# EAGLE design USB_Power_Board (EAGLE 7.3.0)
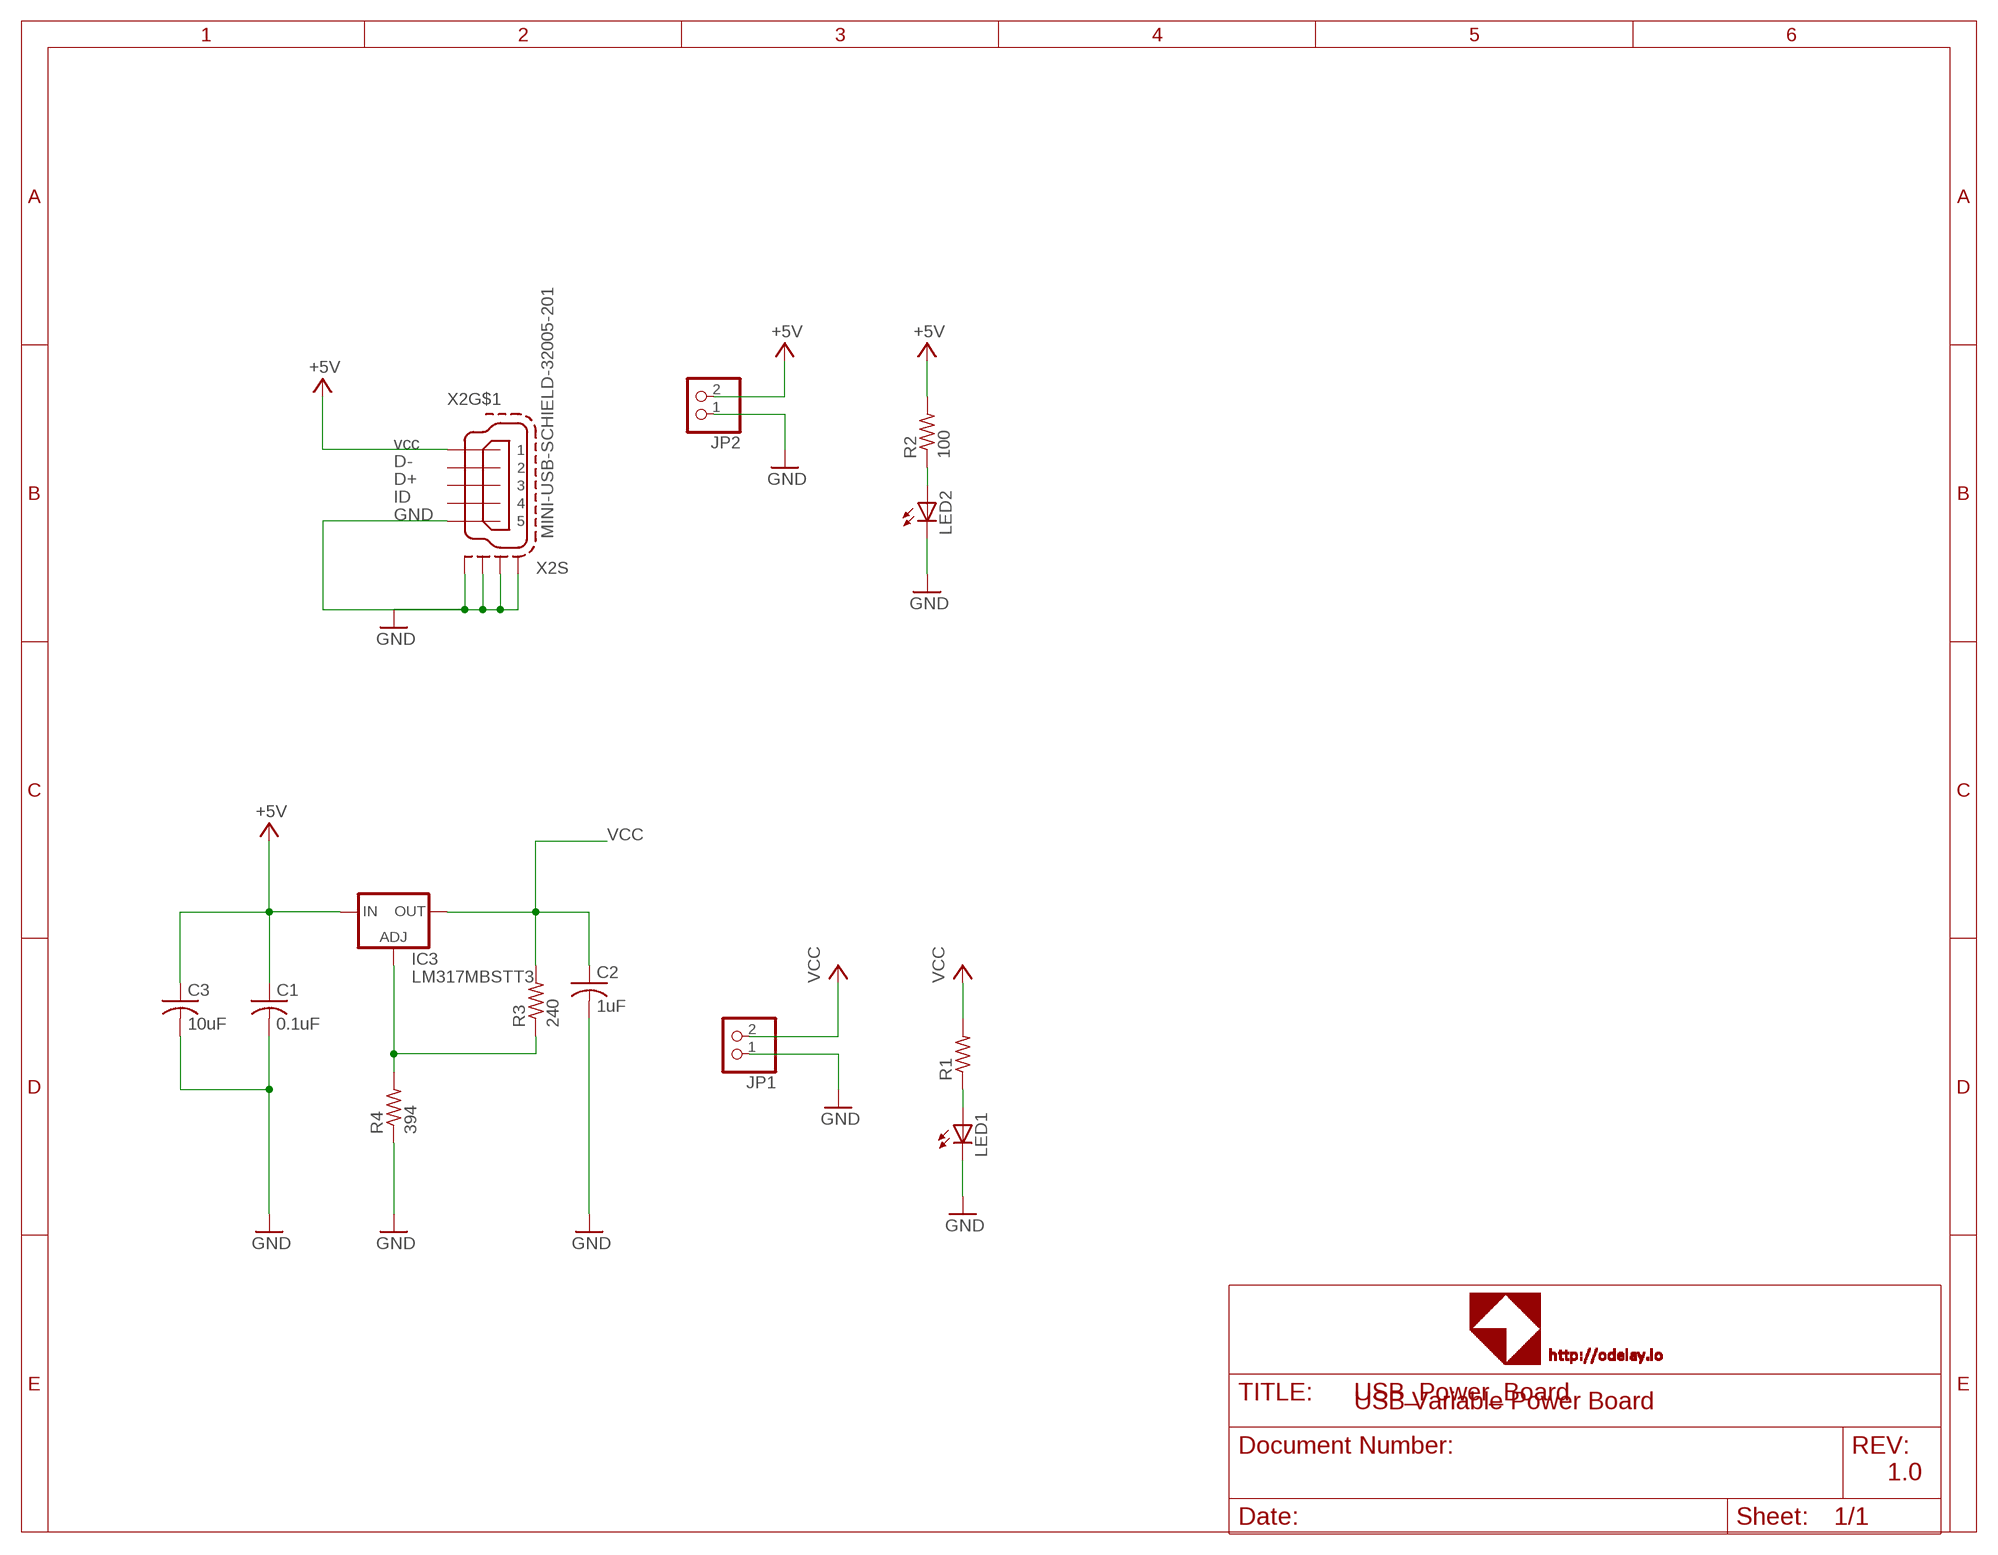
[diagram p0: schematic, sheet 1]

## Parts
C1  0.1uF  C-USC0402  [C0402]
C2  1uF  C-USC0402  [C0402]
C3  10uF  C-USC0603  [C0603]
IC3  LM317MBSTT3  [SOT223]
JP1  PINHD-1X2  [1X02]
JP2  PINHD-1X2  [1X02]
LED1  LEDCHIP-LED0603  [CHIP-LED0603]
LED2  LEDCHIP-LED0603  [CHIP-LED0603]
R1  R-US_R0402  [R0402]
R2  100  R-US_R0402  [R0402]
R3  240  R-US_R0805  [R0805]
R4  394  R-US_R0805  [R0805]
X2  MINI-USB-SCHIELD-32005-201  [32005-201]

## Nets
+5V: C1.1 C3.1 IC3.3(IN) JP2.2 R2.2 X2.1
GND: C1.2 C2.2 C3.2 JP1.1 JP2.1 LED1.C LED2.C R4.1 X2.5 X2.M1(S:S1) X2.M2(S:S2) X2.M3(S:S3) X2.M4(S:S4)
N$1: LED1.A R1.1
N$2: IC3.1(ADJ) R3.1 R4.2
N$5: LED2.A R2.1
VCC: C2.1 IC3.4(OUT) JP1.2 R1.2 R3.2
Unconnected: X2.2 X2.3 X2.4

## Notes on the sheet
- USB Variable Power Board
- 1.0

## Library data of the parts
C1-C3 = rcl:C-US: CAPACITOR, American symbol
IC3 = v-reg:LM317?*: 500 mA Adjustable Output Positive Voltage Regulator Source: http://www.onsemi.co.jp .. LM317M-D.PDF
JP1 JP2 = pinhead:PINHD-1X2: PIN HEADER
LED1 LED2 = led:LED: LED OSRAM: - CHIPLED LG R971, LG N971, LY N971, LG Q971, LY Q971, LO R971, LY R971 LH N974, LH R974 LS Q976, LO Q976, LY Q976 LO Q996 - Hyper CHIPLED LW Q18S LB Q993, LB Q99A, LB R99A - SideLED LS A670, LO A670, LY A670, LG A670, LP A670 LB A673, LV A673, LT A673, LW A673 LH A674 LY A675 LS A676, LA A676, LO A676, LY A676, LW A676 LS A679, LY A679, LG A679 - Hyper Micro SIDELED® LS Y876, LA Y876, LO Y876, LY Y876 LT Y87S - SmartLED LW L88C, LW L88S LB L89C, LB L89S, LG L890 LS L89K, LO L89K, LY L89K LS L896, LA L896, LO L896, LY L896 - TOPLED LS T670, LO T670, LY T670, LG T670, LP T670 LSG T670, LSP T670, LSY T670, LOP T670, LYG T670 LG T671, LOG T671, LSG T671 LB T673, LV T673, LT T673, LW T673 LH T674 LS T676, LA T676, LO T676, LY T676, LB T676, LH T676, LSB T676, LW T676 LB T67C, LV T67C, LT T67C, LS T67K, LO T67K, LY T67K, LW E67C LS E67B, LA E67B, LO E67B, LY E67B, LB E67C, LV E67C, LT E67C LW T67C LS T679, LY T679, LG T679 LS T770, LO T770, LY T770, LG T770, LP T770 LB T773, LV T773, LT T773, LW T773 LH T774 LS E675, LA E675, LY E675, LS T675 LS T776, LA T776, LO T776, LY T776, LB T776 LHGB T686 LT T68C, LB T68C - Hyper Mini TOPLED® LB M676 - Mini TOPLED Santana® LG M470 LS M47K, LO M47K, LY M47K Source: http://www.osram.convergy.de LUXEON: - LUMILED® LXK2-PW12-R00, LXK2-PW12-S00, LXK2-PW14-U00, LXK2-PW14-V00 LXK2-PM12-R00, LXK2-PM12-S00, LXK2-PM14-U00 LXK2-PE12-Q00, LXK2-PE12-R00, LXK2-PE12-S00, LXK2-PE14-T00, LXK2-PE14-U00 LXK2-PB12-K00, LXK2-PB12-L00, LXK2-PB12-M00, LXK2-PB14-N00, LXK2-PB14-P00, LXK2-PB14-Q00 LXK2-PR12-L00, LXK2-PR12-M00, LXK2-PR14-Q00, LXK2-PR14-R00 LXK2-PD12-Q00, LXK2-PD12-R00, LXK2-PD12-S00 LXK2-PH12-R00, LXK2-PH12-S00 LXK2-PL12-P00, LXK2-PL12-Q00, LXK2-PL12-R00 Source: www.luxeon.com KINGBRIGHT: KA-3528ASYC Source: www.kingbright.com
R1-R4 = resistor:R-US_: RESISTOR, American symbol
X2 = con-cypressindustries:MINI-USB-SCHIELD-: MINI USB-B Conector Source: www.cypressindustries.com; OC_FARNELL: unknown; OC_NEWARK: unknown

## Board
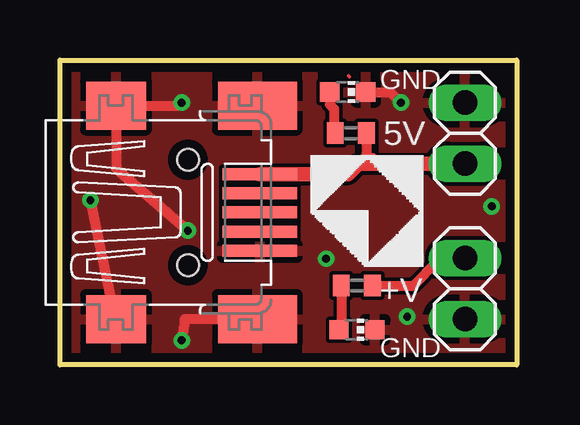
[diagram p1: board, top side]
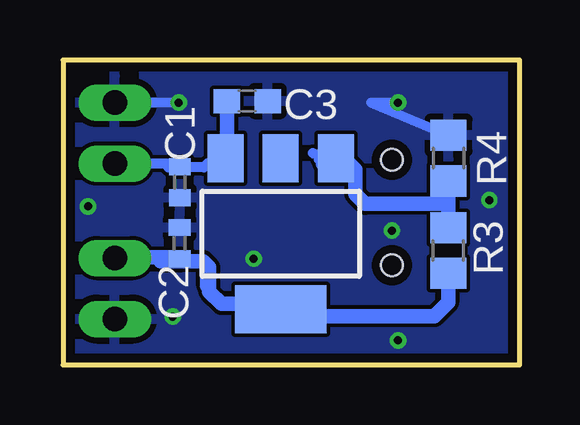
[diagram p2: board, bottom side, seen from below]

Size 19.05 x 12.7 mm. Coordinates in mm from the lower left corner, seen from the top.
Outline: 0,0 0,12.7 19.05,12.7 19.05,0 0,0
Copper layers (1*16): Top 0.0356mm / dielectric 1.5011mm / Bottom 0.0356mm
Design rules "oshpark-2layer": minimum track width 6mil, minimum drill 13mil, track to track 6mil, track to pad 6mil, pad to pad 6mil, via to via 6mil, smd to smd 6mil, copper to edge 15mil, drill to drill 6mil, minimum pad ring 7mil, minimum via ring 7mil, stop-mask expansion 2.5mil, vias tented up to drill 0mil, thermal gap 10mil

### Footprints (pad centres in the part's own frame; a part is rotated, then mirrored left to right if it is on the bottom)
C0402 = smd 0.7 x 0.9: 1 -0.65,0; 2 0.65,0
C0603 = smd 1.1 x 1: 1 -0.85,0; 2 0.85,0
SOT223 = smd 1.5 x 2: 1 -2.3,-3.15; 2 0,-3.15; 3 2.3,-3.15 | smd 3.8 x 2: 4 0,3.15
1X02 = drill 1.016 long: 1 -1.27,0; 2 1.27,0
CHIP-LED0603 = smd 0.8 x 0.8: A 0,-0.75; C 0,0.75
R0402 = smd 0.7 x 0.9: 1 -0.65,0; 2 0.65,0
R0805 = smd 1.3 x 1.5: 1 -0.95,0; 2 0.95,0
32005-201 = smd 3.1 x 0.5: 1 3,1.6; 2 3,0.8; 3 3,0; 4 3,-0.8; 5 3,-1.6 | smd 2.5 x 2: M1 -3,-4.45; M2 -3,4.45 | smd 3.3 x 2: M3 2.9,4.45; M4 2.9,-4.45 | hole 0.9: 0,2.2; 0,-2.2

### Placement (x,y rotation side)
C1  14.17,7.61 270 bottom
C2  14.19,5.07 90 bottom
C3  11.37,10.99 0 bottom
IC3  9.97,5.46 180 bottom
JP1  16.89,3.18 90 top
JP2  16.89,9.65 270 top
LED1  12.38,1.46 270 top
LED2  12,11.37 270 top
R1  12.38,3.3 0 top
R2  12.13,9.65 0 top
R3  2.98,4.76 270 bottom
R4  2.97,8.61 270 bottom
X2  5.33,6.35 0 top

### Tracks (layer width: path | path; a pad name or v marks a point on that pad's centre or on a via)
+5V
  Top 0.406: R2.2 12.78,8.71 12.45,8.38 12.8,8.38 13.03,8.61
  Top 0.61: X2.1 12.01,7.95 12.45,8.38 JP2.2
  Bottom 0.406: 16.77,8.26 JP2.2 14.56,8.38 C1.1 14.65,8.23 13.18,8.23 13.03,8.38 IC3.3 12.72,8.92
  Bottom 0.61: C3.1 12.22,8.66 IC3.3
GND  (via drill 0.33)
  Top 0.406: v5.33,5.59 2.33,8.18 X2.M2 4.96,10.8 v5.08,10.92 | v1.27,6.86 2.29,1.95 X2.M1 | LED2.C 13.78,11.37 v14.22,10.92 | X2.M4 5.21,1.9 v5.08,1.02
  Bottom 0.406: v5.08,10.92 6.21,10.92 R4.1 | v14.22,10.92 JP2.1
  other vias: 18.01,6.6 11.1,4.42 14.48,2.01
  pour Bottom: 0.51,12.19 18.54,12.19 18.54,0.51 0.51,0.51 0.51,11.94
  pour Top: 0.51,12.19 18.54,12.19 18.54,0.51 0.51,0.51
N$1
  Top 0.406: R1.1 11.73,1.56 LED1.A
N$2
  Bottom 0.406: 8.38,8.56 IC3.1 8.64,8.82
  Bottom 0.61: 2.97,6.71 R3.1 | R4.2 2.97,6.71 | 2.97,6.71 6.45,6.71 6.86,7.11 6.86,8.13 7.11,8.38 8.2,8.38 IC3.1 7.95,8.13
N$3
  Top 0.152: 12.04,12.04 12.08,12
N$5
  Top 0.406: LED2.A 11.25,10.85 11.43,10.67 11.43,10.21 R2.1
VCC
  Top 0.406: R1.2 14.73,3.3 15.75,4.32 16.76,4.32 JP1.2
  Bottom 0.406: 10.16,2.31 IC3.4 9.68,2.31 9.4,2.03 7.61,2.03 | 16.92,4.47 JP1.2 16.76,4.32
  Bottom 0.61: R3.2 2.98,2.6 3.56,2.03 9.88,2.03 10.16,2.31 | IC3.4 10.96,2.54 12.45,2.54 12.95,3.05 12.95,3.22 | 16.92,4.47 14.24,4.47 C2.1 14.09,4.32 | 14.99,4.32 14.09,4.32 | 13.03,4.14 12.95,4.06 12.95,3.22 | 12.95,3.22 R1.2 13.03,4.14 | 13.03,4.14 13.21,4.32 14.09,4.32

### Text on the board
tNames: GND | 5V | +V | GND